# EAGLE design IR-Receiver-v10 (EAGLE 6.3)
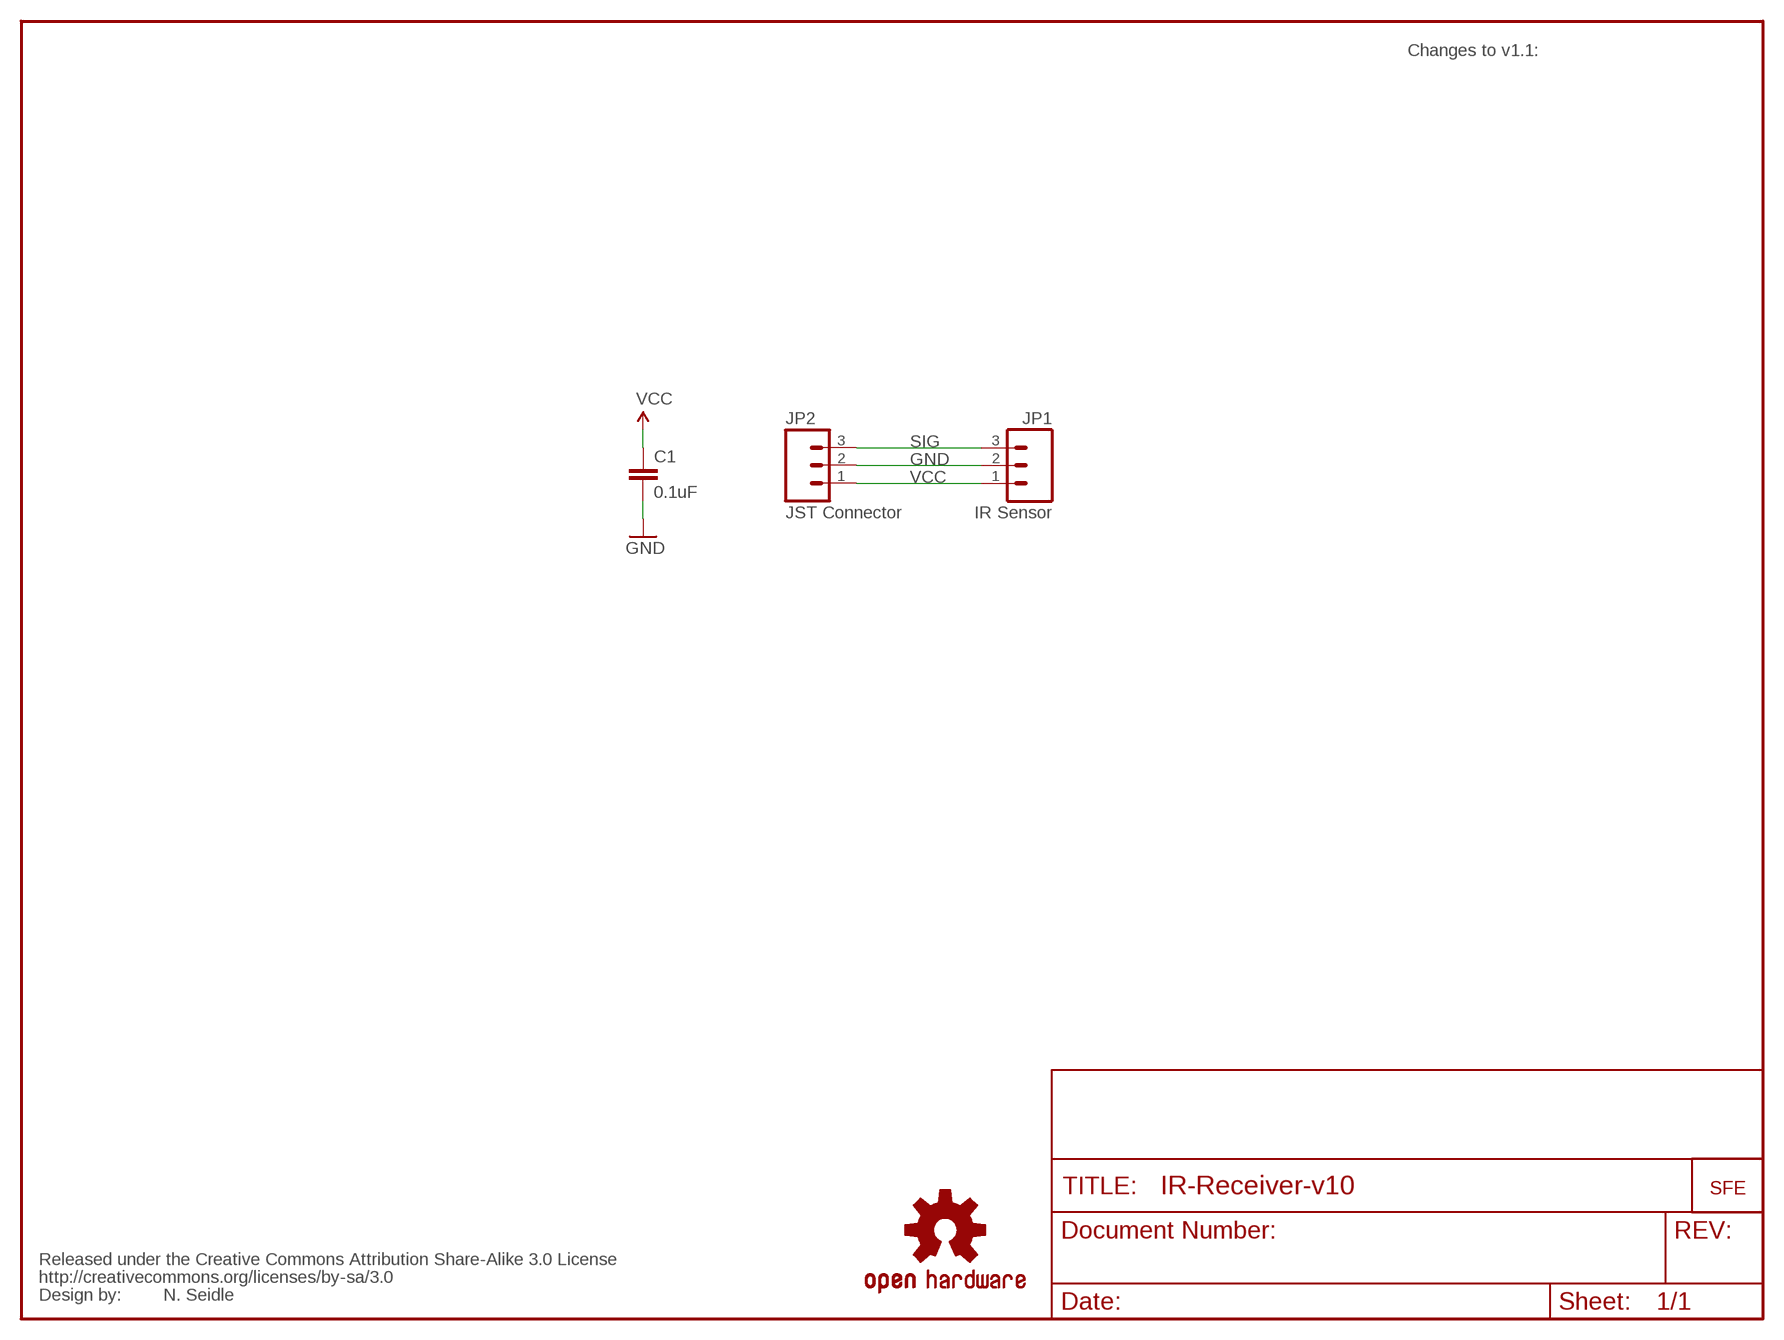
[diagram p0: schematic, sheet 1]

## Parts
C1  0.1uF  CAPPTH2  [CAP-PTH-SMALL2]
JP1  IR Sensor  M03PTH  [1X03]
JP2  JST Connector  M03JST-PTH  [JST-3-PTH]
U$1  LOGO-SFESK  [SFE-LOGO-FLAME]
U$2  CREATIVE_COMMONS  [CREATIVE_COMMONS]
U$4  OSHW-LOGOS  [OSHW-LOGO-S]

## Nets
GND: C1.2 JP1.2 JP2.2
SIG: JP1.3 JP2.3
VCC: C1.1 JP1.1 JP2.1

## Notes on the sheet
- Changes to v1.1:
- N. Seidle

## Library data of the parts
C1 = SparkFun:CAP: Capacitor Standard 0603 ceramic capacitor, and 0.1" leaded capacitor.
JP1 JP2 = SparkFun-Connectors:M03: Header 3 Standard 3-pin 0.1" header. Use with straight break away headers (SKU : PRT-00116), right angle break away headers (PRT-00553), swiss pins (PRT-00743), machine pins (PRT-00117), and female headers (PRT-00115). Molex polarized connector foot print use with SKU : PRT-08232 with associated crimp pins and housings.
U$1 = SparkFun:LOGO-SFE: Spark Fun Electronics PCB Logo This is the standard Spark Fun Electronics PCB logo.
U$2 = SparkFun:CREATIVE_COMMONS
U$4 = SparkFun:OSHW-LOGO: Open Source Hardware Logo This logo indicates the piece of hardware it is found on incorporates a OSHW license and/or adheres to the definition of open source hardware found here: http://freedomdefined.org/OSHW

## Board
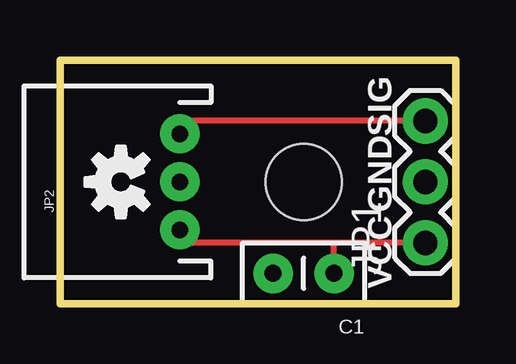
[diagram p1: board, top side]
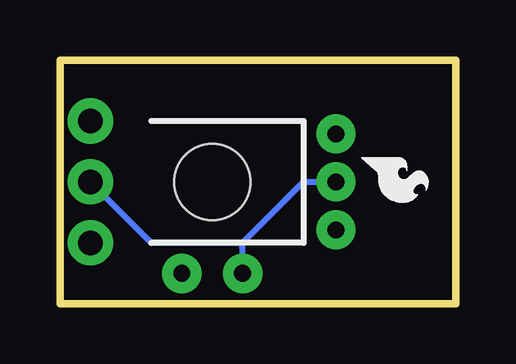
[diagram p2: board, bottom side, seen from below]

Size 16.51 x 10.16 mm. Coordinates in mm from the lower left corner, seen from the top.
Outline: 0,10.16 0,0 16.51,0 16.51,10.16 0,10.16
Copper layers (1*16): Top 0.035mm / dielectric 1.5mm / Bottom 0.035mm
Design rules "SparkFun": minimum track width 8mil, minimum drill 20mil, track to track 8mil, track to pad 8mil, pad to pad 8mil, via to via 8mil, smd to smd 8mil, copper to edge 10mil, drill to drill 8mil, minimum pad ring 12mil, minimum via ring 10mil, stop-mask expansion 4mil, vias tented up to drill 20mil, thermal gap 10mil
Holes 3.17 mm at 10.16,5.08

### Footprints (pad centres in the part's own frame; a part is rotated, then mirrored left to right if it is on the bottom)
CAP-PTH-SMALL2 = drill 0.7 pad 1.651: 1 0,0; 2 2.54,0
1X03 = drill 1.016 pad 1.88: 1 0,0; 2 2.54,0; 3 5.08,0
JST-3-PTH = drill 0.7 pad 1.626: 1 -2,-5; 2 0,-5; 3 2,-5

### Placement (x,y rotation side)
C1  11.43,1.27 180 top
JP1  15.24,2.54 90 top
JP2  0,5.08 90 top
U$1  3.94,6.1 270 bottom
U$2  -6.35,-10.16 0 top  (outside the outline)
U$4  2.54,5.08 90 top

### Tracks (layer width: path | path; a pad name or v marks a point on that pad's centre or on a via)
GND
  Bottom 0.254: JP1.2 12.7,2.54 8.89,2.54 | 8.89,2.54 6.35,5.08 JP2.2 | C1.2 8.89,2.54
SIG
  Top 0.254: JP1.3 5.54,7.62 JP2.3
VCC
  Top 0.254: JP1.1 11.43,2.54 | 11.43,2.54 5.54,2.54 JP2.1 | C1.1 11.43,2.54

### Text on the board
tPlace: SIG | GND | VCC
tDocu: N. Seidle